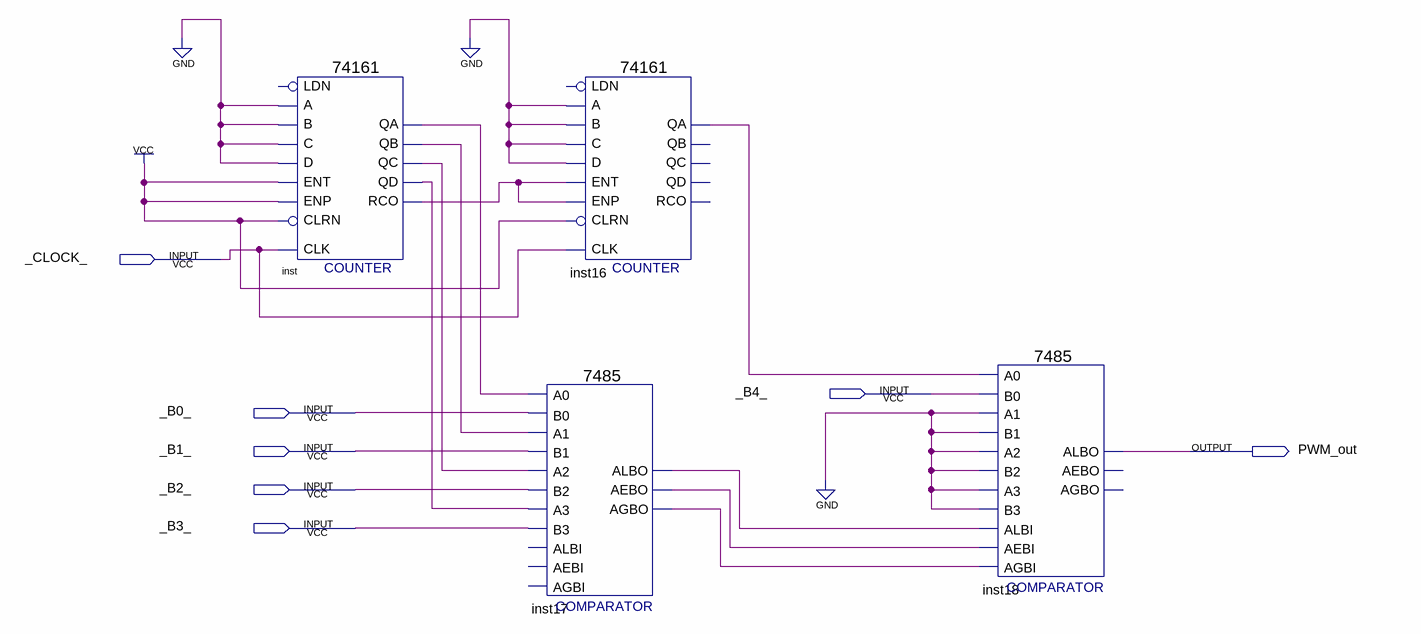
[diagram p0: schematic sheet]
// Quartus schematic PWM.bdf as structural Verilog: 4 symbols, 7 pins
module PWM (
  input  _CLOCK_,
  input  _B4_,
  input  _B0_,
  input  _B1_,
  input  _B2_,
  input  _B3_,
  output PWM_out
);

  wire inst16_qa, inst17_aebo, inst17_agbo, inst17_albo, inst_qa, inst_qb, inst_qc, inst_qd, inst_rco;

  \74161  inst (
    .CLRN(1'b1), .CLK(_CLOCK_), .ENP(1'b1), .A(1'b0), .D(1'b0), .ENT(1'b1), .B(1'b0), .C(1'b0), .QD(inst_qd),
    .QC(inst_qc), .QB(inst_qb), .QA(inst_qa), .RCO(inst_rco));  // open: LDN
  \7485  inst17 (
    .A3(inst_qd), .B2(_B2_), .A2(inst_qc), .A0(inst_qa), .B0(_B0_), .B3(_B3_), .A1(inst_qb), .B1(_B1_),
    .ALBO(inst17_albo), .AGBO(inst17_agbo), .AEBO(inst17_aebo));  // open: AEBI, AGBI, ALBI
  \74161  inst16 (
    .CLRN(1'b1), .CLK(_CLOCK_), .ENP(inst_rco), .A(1'b0), .D(1'b0), .ENT(inst_rco), .B(1'b0), .C(1'b0),
    .QA(inst16_qa));  // open: LDN, QD, QC, QB, RCO
  \7485  inst18 (
    .A3(1'b0), .B2(1'b0), .A2(1'b0), .AEBI(inst17_aebo), .AGBI(inst17_agbo), .ALBI(inst17_albo),
    .A0(inst16_qa), .B0(_B4_), .B3(1'b0), .A1(1'b0), .B1(1'b0), .ALBO(PWM_out));  // open: AGBO, AEBO
endmodule
